# Altium schematic sheet Mainboard_Geneva_Interface.SchDoc
size A
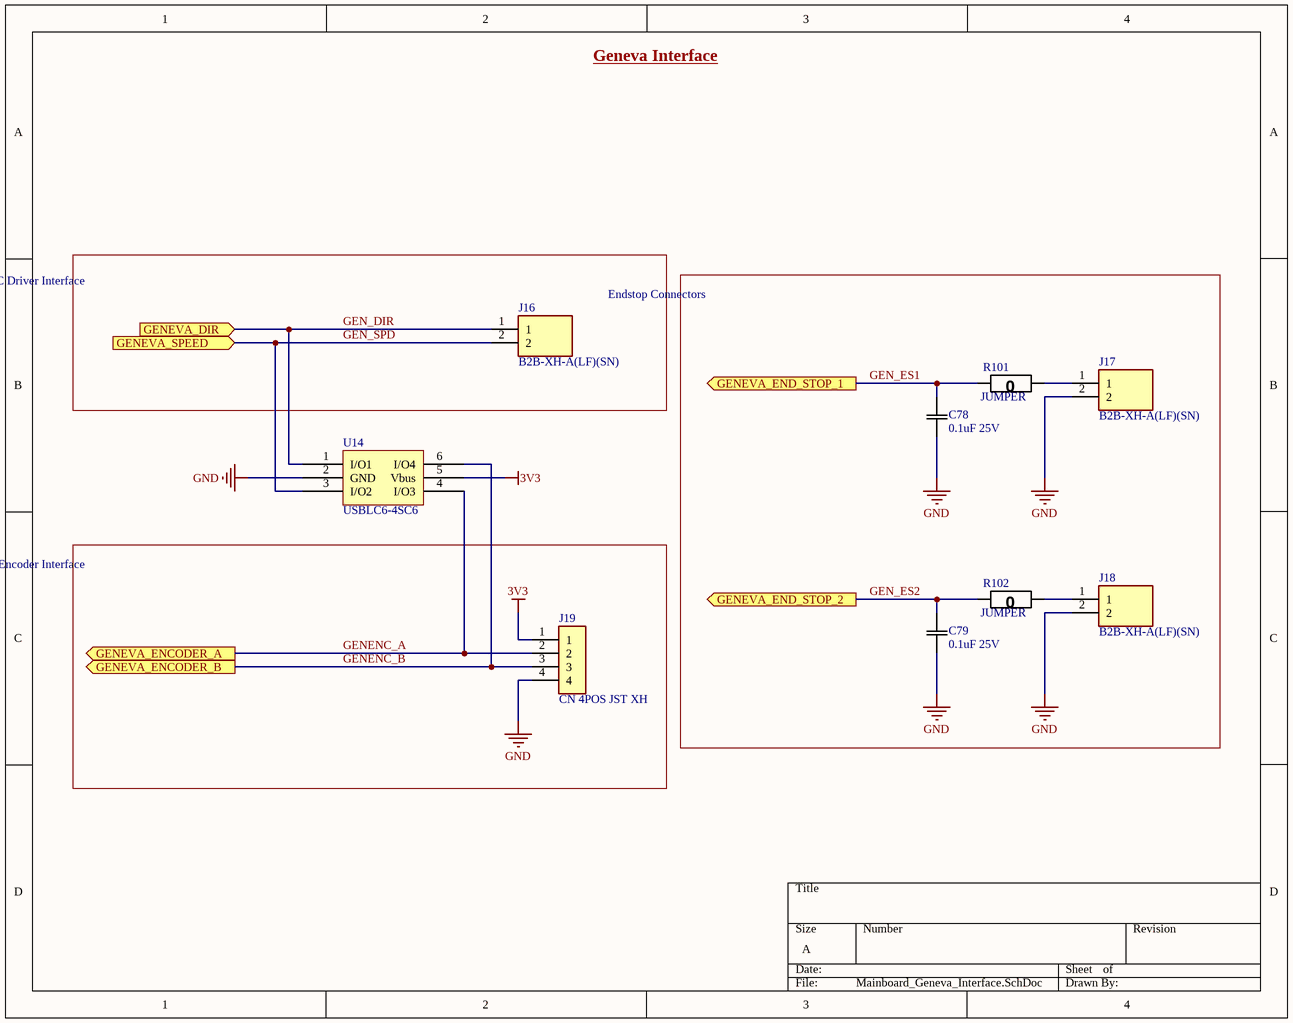
[diagram p0: Mainboard_Geneva_Interface.SchDoc]

## Parts
C78  0.1uF 25V  [0805]
C79  0.1uF 25V  [0805]
J16  B2B-XH-A(LF)(SN)  [JST_B2B-XH-A(LF)(SN)]
J17  B2B-XH-A(LF)(SN)  [JST_B2B-XH-A(LF)(SN)]
J18  B2B-XH-A(LF)(SN)  [JST_B2B-XH-A(LF)(SN)]
J19  CN 4POS JST XH  [JST_B4B-XH-A(LF)(SN)]
R101  JUMPER  [0805]
R102  JUMPER  [0805]
U14  USBLC6-4SC6  [SOT23-6L]

## Blocks framed on the sheet
DC Driver Interface: J16
Endstop Connectors: C78 C79 J17 J18 R101 R102
Encoder Interface: J19

## Ports
GENEVA_DIR (in), GENEVA_ENCODER_A (out), GENEVA_ENCODER_B (out), GENEVA_END_STOP_1 (out), GENEVA_END_STOP_2 (out), GENEVA_SPEED (in)

## Nets
3V3: J19.1 U14.5(Vbus)
GND: C78.2(C2) C79.2(C2) J17.2 J18.2 J19.4 U14.2(GND)
GEN_DIR: J16.1 U14.1(I/O1) ; port GENEVA_DIR
GEN_ES1: C78.1(C1) R101.2(R2) ; port GENEVA_END_STOP_1
GEN_ES2: C79.1(C1) R102.2(R2) ; port GENEVA_END_STOP_2
GEN_SPD: J16.2 U14.3(I/O2) ; port GENEVA_SPEED
GENENC_A: J19.2 U14.4(I/O3) ; port GENEVA_ENCODER_A
GENENC_B: J19.3 U14.6(I/O4) ; port GENEVA_ENCODER_B
NetJ17_1: J17.1 R101.1(R1)
NetJ18_1: J18.1 R102.1(R1)

## Notes on the sheet
- Geneva Interface

## Library data of the parts
C78 C79 = CAP 0.1uF 25V: CAP CER 0.1UF 25V X7R 0805; Tolerance: 10%; Value: 0.1uF; Temperature Coefficient: X7R; Rating: 25V; Operating Temperature: -55°C ~ 125°C
J16-J18 = B2B-XH-A(LF)(SN): Connector Header Through Hole 2 position 0.098 _2.50mm_ / JST XH; MP: B2B-XH-A_LF__SN_; MF: JST Sales; Price: None; Package: None; Value: *; Availability: Unavailable; SnapEDA_Link: https://www.snapeda.com/parts/B2B-XH-A%28LF%29%28SN%29/JST%20Sales%20America%20Inc./view-part/492310/?ref=snap
J19 = CN 4POS JST XH: Connector Header Through Hole 4 position 0.098 _2.50mm_ / B4B-XH-A(LF)(SN); MP: B4B-XH-A_LF__SN_; MF: JST Sales; Price: None; Package: None; Value: *; Availability: Unavailable; SnapEDA_Link: https://www.snapeda.com/parts/B4B-XH-A%28LF%29%28SN%29/JST%20Sales%20America%20Inc./view-part/447494/?ref=snap
R101 R102 = RES 0 JUMPER: RES SMD 0 OHM JUMPER GENERIC 0805; Value: 0; Package: 0805